# EAGLE design Magic_Desk_128_1MB_Rev1 (EAGLE 9.7.0)
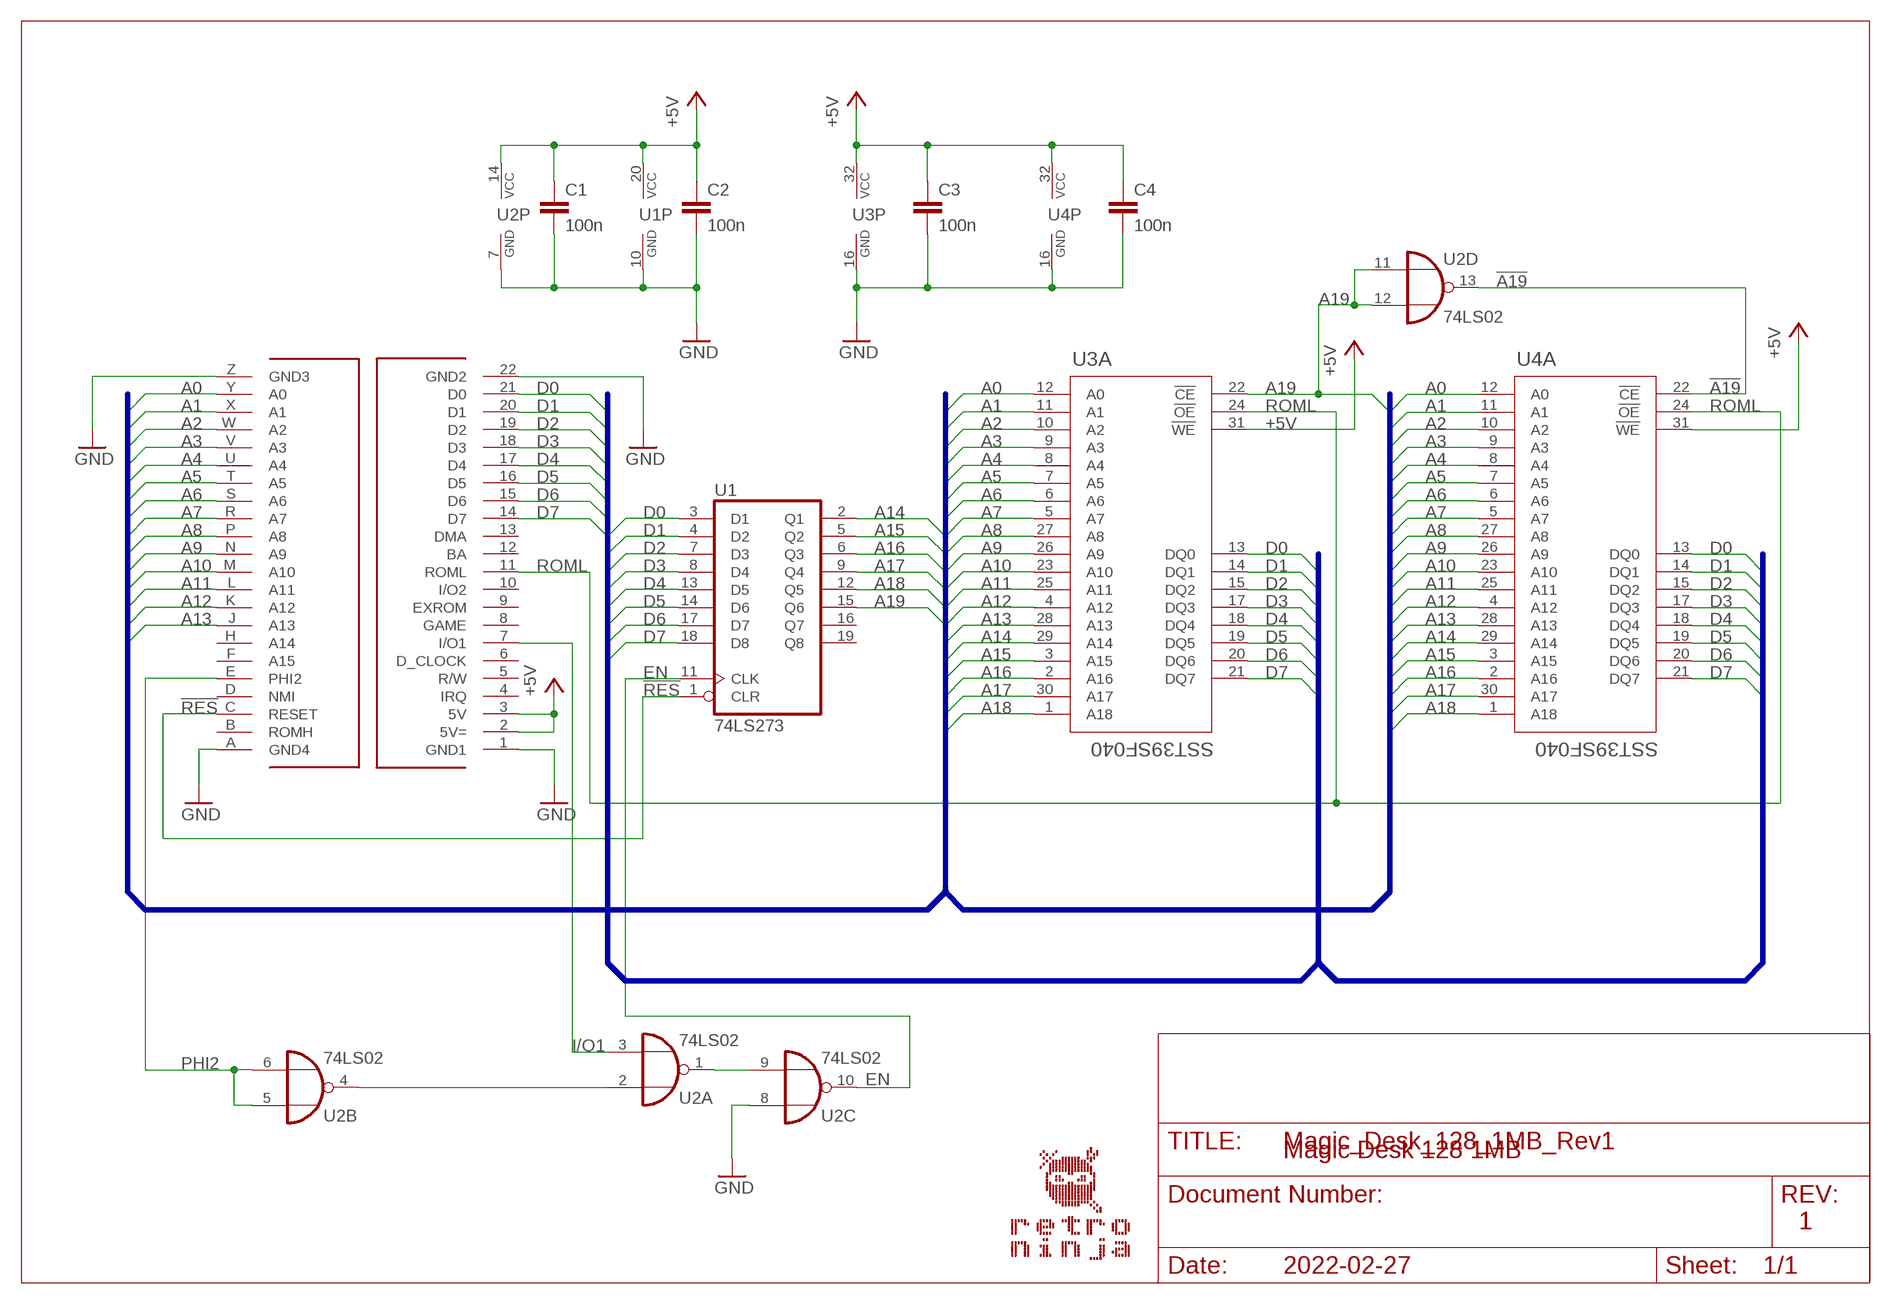
[diagram p0: schematic, sheet 1]

## Parts
C1  100n  CAPACITOR-5  [CAP_5MM_2.5X5.0_ROUND]
C2  100n  CAPACITOR-5  [CAP_5MM_2.5X5.0_ROUND]
C3  100n  CAPACITOR-5  [CAP_5MM_2.5X5.0_ROUND]
C4  100n  CAPACITOR-5  [CAP_5MM_2.5X5.0_ROUND]
CN1  C64_CARTRIDGE_PORT_CARTEDGE  [C64_CARTRIDGE_BOARDEDGE]
U1  74LS273  74HCT273N  [DIL20]
U2  74LS02  74LS02N  [DIL14]
U3  SST39SF040  SST39XX040DIL  [DIL32-6]
U4  SST39SF040  SST39XX040DIL  [DIL32-6]

## Nets
!A19: U2.13(D:O) U4.22(A:!CE)
!RES: CN1.C(RESET) U1.1(CLR)
+5V: C1.1 C2.1 C3.1 C4.1 CN1.2(5V=) CN1.3(5V) U1.20(VCC) U2.14(P:VCC) U3.31(A:!WE) U3.32(P:VCC) U4.31(A:!WE) U4.32(P:VCC)
A0: CN1.Y(A0) U3.12(A:A0) U4.12(A:A0)
A1: CN1.X(A1) U3.11(A:A1) U4.11(A:A1)
A2: CN1.W(A2) U3.10(A:A2) U4.10(A:A2)
A3: CN1.V(A3) U3.9(A:A3) U4.9(A:A3)
A4: CN1.U(A4) U3.8(A:A4) U4.8(A:A4)
A5: CN1.T(A5) U3.7(A:A5) U4.7(A:A5)
A6: CN1.S(A6) U3.6(A:A6) U4.6(A:A6)
A7: CN1.R(A7) U3.5(A:A7) U4.5(A:A7)
A8: CN1.P(A8) U3.27(A:A8) U4.27(A:A8)
A9: CN1.N(A9) U3.26(A:A9) U4.26(A:A9)
A10: CN1.M(A10) U3.23(A:A10) U4.23(A:A10)
A11: CN1.L(A11) U3.25(A:A11) U4.25(A:A11)
A12: CN1.K(A12) U3.4(A:A12) U4.4(A:A12)
A13: CN1.J(A13) U3.28(A:A13) U4.28(A:A13)
A14: U1.2(Q1) U3.29(A:A14) U4.29(A:A14)
A15: U1.5(Q2) U3.3(A:A15) U4.3(A:A15)
A16: U1.6(Q3) U3.2(A:A16) U4.2(A:A16)
A17: U1.9(Q4) U3.30(A:A17) U4.30(A:A17)
A18: U1.12(Q5) U3.1(A:A18) U4.1(A:A18)
A19: U1.15(Q6) U2.11(D:I0) U2.12(D:I1) U3.22(A:!CE)
D0: CN1.21(D0) U1.3(D1) U3.13(A:DQ0) U4.13(A:DQ0)
D1: CN1.20(D1) U1.4(D2) U3.14(A:DQ1) U4.14(A:DQ1)
D2: CN1.19(D2) U1.7(D3) U3.15(A:DQ2) U4.15(A:DQ2)
D3: CN1.18(D3) U1.8(D4) U3.17(A:DQ3) U4.17(A:DQ3)
D4: CN1.17(D4) U1.13(D5) U3.18(A:DQ4) U4.18(A:DQ4)
D5: CN1.16(D5) U1.14(D6) U3.19(A:DQ5) U4.19(A:DQ5)
D6: CN1.15(D6) U1.17(D7) U3.20(A:DQ6) U4.20(A:DQ6)
D7: CN1.14(D7) U1.18(D8) U3.21(A:DQ7) U4.21(A:DQ7)
EN: U1.11(CLK) U2.10(C:O)
GND: C1.2 C2.2 C3.2 C4.2 CN1.1(GND1) CN1.22(GND2) CN1.A(GND4) CN1.Z(GND3) U1.10(GND) U2.7(P:GND) U2.8(C:I0) U3.16(P:GND) U4.16(P:GND)
I/O1: CN1.7(I/O1) U2.3(A:I1)
N$3: U2.2(A:I0) U2.4(B:O)
N$6: U2.1(A:O) U2.9(C:I1)
PHI2: CN1.E(PHI2) U2.5(B:I0) U2.6(B:I1)
ROML: CN1.11(ROML) U3.24(A:!OE) U4.24(A:!OE)
Unconnected: CN1.4(IRQ) CN1.5(R/W) CN1.6(D_CLOCK) CN1.8(GAME) CN1.9(EXROM) CN1.10(I/O2) CN1.12(BA) CN1.13(DMA) CN1.B(ROMH) CN1.D(NMI) CN1.F(A15) CN1.H(A14) U1.16(Q7) U1.19(Q8)

## Buses
ADDR:A[0..21]
DATA:D[0..7]

## Notes on the sheet
- Magic Desk 128 1MB
- 1
- 2022-02-27

## Library data of the parts
C1-C4 = Per (Fusion 360):CAPACITOR
CN1 = Per (Fusion 360):C64_CARTRIDGE_PORT
U1 = 74xx-eu:74*273: Octal D type FLIP FLOP, clear
U2 = 74xx-eu:74*02: Quad 2-input NOR gate
U3 U4 = Per (Fusion 360):SST39XX040

## Board
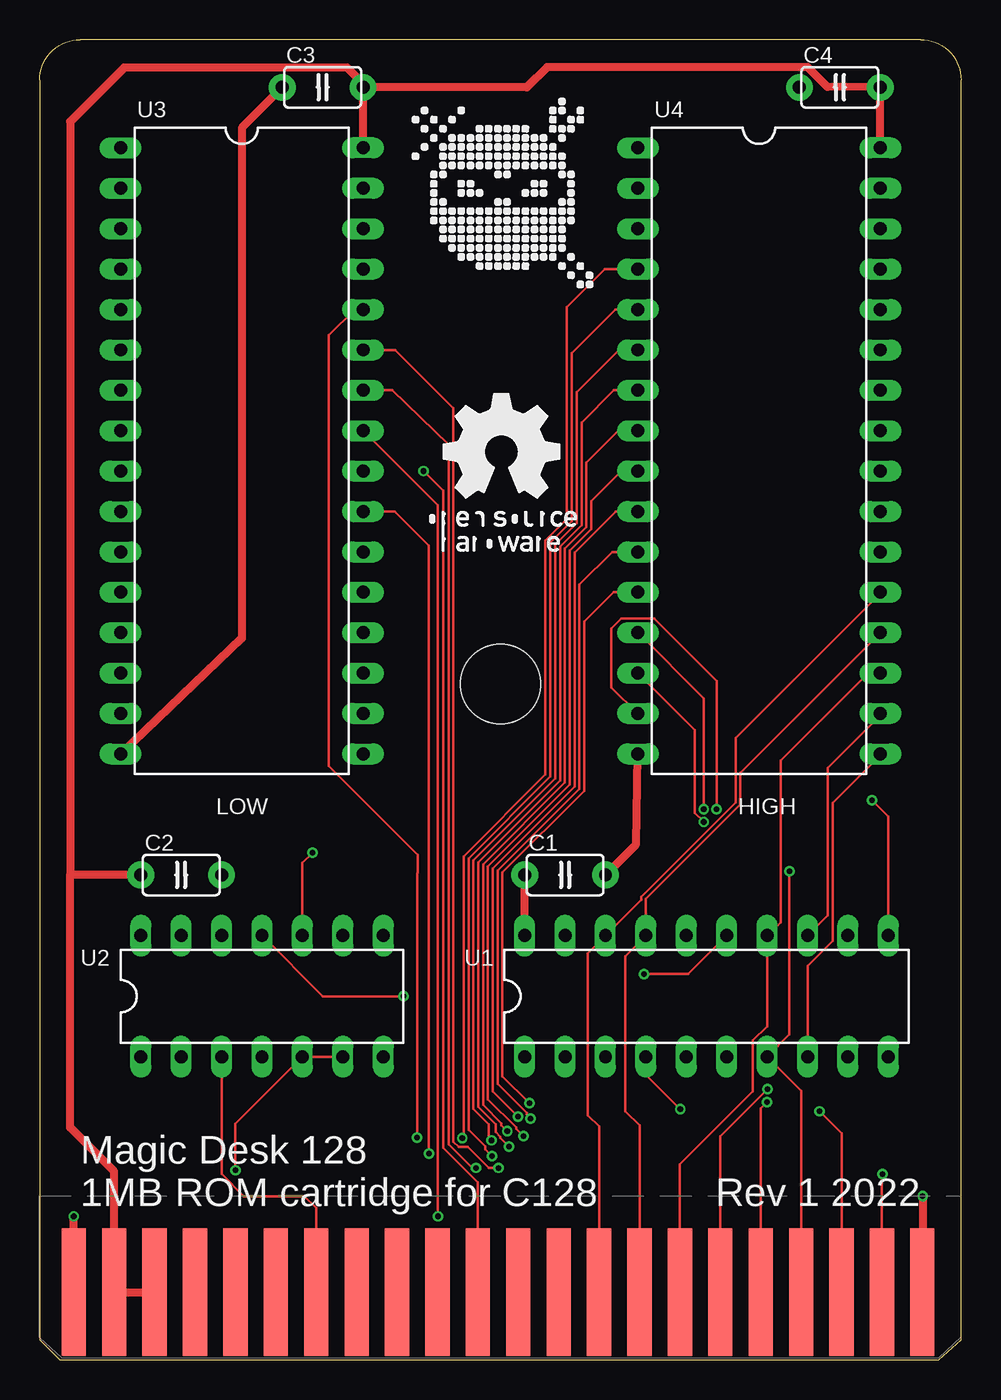
[diagram p1: board, top side]
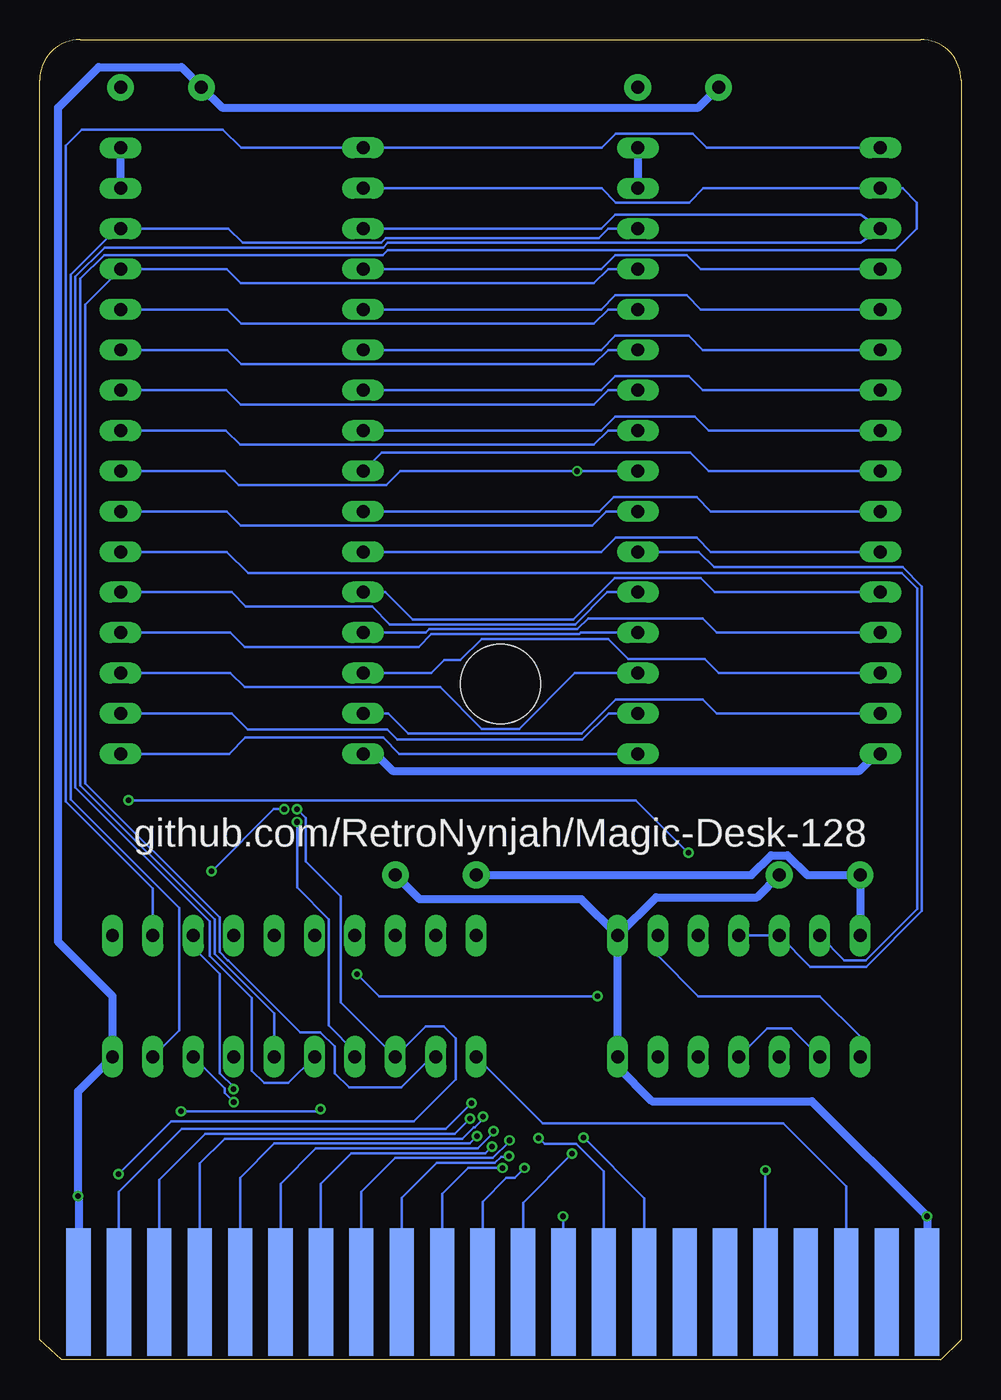
[diagram p2: board, bottom side, seen from below]

Size 57.91 x 83 mm. Coordinates in mm from the lower left corner, seen from the top.
Outline: 57.91,1.27 57.91,80.46 arc91 55.37,83 2.54,83 arc91 0,80.46 0,1.27 1.27,0 56.52,0 57.91,1.27
Copper layers (1*16): Top 0.035mm / dielectric 1.5mm / Bottom 0.035mm
Design rules "SeeedStudio_2layer_DRU_no_angle_20140221": minimum track width 6mil, minimum drill 12mil, track to track 6mil, track to pad 6mil, pad to pad 6mil, via to via 6mil, smd to smd 0mil, copper to edge 10mil, drill to drill 10mil, minimum pad ring 10mil, minimum via ring 6mil, stop-mask expansion 2mil, vias tented up to drill 100mil, thermal gap 10mil
Holes 5 mm at 28.96,42.5

### Footprints (pad centres in the part's own frame; a part is rotated, then mirrored left to right if it is on the bottom)
CAP_5MM_2.5X5.0_ROUND = drill 0.813 pad 1.676: 1 -2.54,0; 2 2.54,0
C64_CARTRIDGE_BOARDEDGE = smd 1.524 x 8.001: 1 2.159,4.115; 2 4.699,4.115; 3 7.239,4.115; 4 9.779,4.115; 5 12.319,4.115; 6 14.859,4.115; 7 17.399,4.115; 8 19.939,4.115; 9 22.479,4.115; 10 25.019,4.115; 11 27.559,4.115; 12 30.099,4.115; 13 32.639,4.115; 14 35.179,4.115; 15 37.719,4.115; 16 40.259,4.115; 17 42.799,4.115; 18 45.339,4.115; 19 47.879,4.115; 20 50.419,4.115; 21 52.959,4.115; 22 55.499,4.115 | smd 1.524 x 8.001 bottom: A 2.159,4.115; B 4.699,4.115; C 7.239,4.115; D 9.779,4.115; E 12.319,4.115; F 14.859,4.115; H 17.399,4.115; J 19.939,4.115; K 22.479,4.115; L 25.019,4.115; M 27.559,4.115; N 30.099,4.115; P 32.639,4.115; R 35.179,4.115; S 37.719,4.115; T 40.259,4.115; U 42.799,4.115; V 45.339,4.115; W 47.879,4.115; X 50.419,4.115; Y 52.959,4.115; Z 55.499,4.115
DIL20 = drill 0.813 long: 1 -11.43,-3.81; 2 -8.89,-3.81; 3 -6.35,-3.81; 4 -3.81,-3.81; 5 -1.27,-3.81; 6 1.27,-3.81; 7 3.81,-3.81; 8 6.35,-3.81; 9 8.89,-3.81; 10 11.43,-3.81; 11 11.43,3.81; 12 8.89,3.81; 13 6.35,3.81; 14 3.81,3.81; 15 1.27,3.81; 16 -1.27,3.81; 17 -3.81,3.81; 18 -6.35,3.81; 19 -8.89,3.81; 20 -11.43,3.81
DIL14 = drill 0.813 long: 1 -7.62,-3.81; 2 -5.08,-3.81; 3 -2.54,-3.81; 4 0,-3.81; 5 2.54,-3.81; 6 5.08,-3.81; 7 7.62,-3.81; 8 7.62,3.81; 9 5.08,3.81; 10 2.54,3.81; 11 0,3.81; 12 -2.54,3.81; 13 -5.08,3.81; 14 -7.62,3.81
DIL32-6 = drill 0.813 long: 1 -16.51,-7.62; 2 -13.97,-7.62; 3 -11.43,-7.62; 4 -8.89,-7.62; 5 -6.35,-7.62; 6 -3.81,-7.62; 7 -1.27,-7.62; 8 1.27,-7.62; 9 3.81,-7.62; 10 6.35,-7.62; 11 8.89,-7.62; 12 11.43,-7.62; 13 13.97,-7.62; 14 16.51,-7.62; 15 19.05,-7.62; 16 21.59,-7.62; 17 21.59,7.62; 18 19.05,7.62; 19 16.51,7.62; 20 13.97,7.62; 21 11.43,7.62; 22 8.89,7.62; 23 6.35,7.62; 24 3.81,7.62; 25 1.27,7.62; 26 -1.27,7.62; 27 -3.81,7.62; 28 -6.35,7.62; 29 -8.89,7.62; 30 -11.43,7.62; 31 -13.97,7.62; 32 -16.51,7.62

### Placement (x,y rotation side)
C1  33.02,30.48 0 top
C2  8.89,30.48 0 top
C3  17.78,80.01 180 top
C4  50.29,80.01 180 top
CN1  -0.02,0.14 0 top
U1  41.91,22.86 0 top
U2  13.97,22.86 0 top
U3  12.7,59.69 270 top
U4  45.21,59.69 270 top
U$1  [RETRONINJA_NOTEXT_12MM]  29.08,73.66 0 top
U$2  [OSHW_10MM]  24.26,50.8 0 top

### Tracks (layer width: path | path; a pad name or v marks a point on that pad's centre or on a via)
!A19
  Bottom 0.152: U2.13 7.34,25.12 5.98,25.12 2.77,28.33 2.77,48.5 3.72,49.45 44.8,49.45 46.15,50.8 U4.22
!RES
  Bottom 0.152: CN1.C 7.22,10.9 11.18,14.86 26.29,14.86 U1.1
+5V
  Top 0.508: CN1.3 CN1.2 4.68,11.83 1.91,14.61 1.91,30.48 | 1.91,30.48 1.91,77.85 5.31,81.25 19.31,81.25 20.32,80.25 C3.1 | C2.1 1.91,30.48 | U1.20 C1.1 | C3.1 30.62,80.01 31.89,81.28 48.27,81.28 49.51,80.03 C4.1 U4.32 | U3.32 C3.1
  Bottom 0.508: U3.32 U3.31 | U2.14 C2.1 9.67,30.48 10.91,31.73 11.95,31.73 13.19,30.48 C1.1 | U4.31 U4.32
A0  (via drill 0.35)
  Top 0.152: U4.12 36.07,48.26 34.23,46.42 34.23,35.78 29.08,30.64 29.08,17.83 v30.77,16.14
  Bottom 0.152: CN1.Y 52.94,10.56 48.99,14.51 32.4,14.51 v30.77,16.14 | U4.12 36.19,48.26 34.48,46.55 24.37,46.55 21.77,49.15 16.37,49.15 15.48,48.26 U3.12
A1  (via drill 0.35)
  Top 0.152: U4.11 35.98,50.8 33.92,48.73 33.92,35.91 28.78,30.76 28.78,17.35 30.61,15.52 30.61,15.42 v30.86,15.16
  Bottom 0.152: U4.11 22.61,50.8 21.72,51.69 16.62,51.69 15.73,50.8 U3.11 | CN1.X 50.4,11.32 47.52,14.21 31.82,14.21 v30.86,15.16
A2  (via drill 0.35)
  Top 0.152: U4.10 36.21,53.34 33.62,50.74 33.62,36.03 28.47,30.89 28.47,16.87 v30.05,15.29
  Bottom 0.152: U4.10 22.73,53.34 21.84,54.23 16.62,54.23 15.73,53.34 U3.10 | CN1.W 47.86,12.34 46.3,13.9 31.35,13.9 30.65,14.61 30.59,14.61 30.05,15.14 v30.05,15.29
A3  (via drill 0.35)
  Top 0.152: U4.9 36.54,55.88 34.66,54 34.66,52.22 33.31,50.87 33.31,36.16 28.17,31.02 28.17,16.38 29.94,14.61 29.94,14.53 v30.42,14.05
  Bottom 0.152: U4.9 36.42,57.05 17.03,57.05 15.86,55.88 U3.9 | CN1.V 45.32,11.45 43.17,13.6 30.87,13.6 v30.42,14.05
A4  (via drill 0.35)
  Top 0.152: U4.8 36.37,58.42 34.36,56.41 34.36,52.35 33.01,50.99 33.01,36.28 27.86,31.14 27.86,16.02 29.02,14.87 29.02,14.75 v29.38,14.38
  Bottom 0.152: U4.8 22.62,58.42 21.73,59.31 16.75,59.31 15.86,58.42 U3.8 | CN1.U 42.78,11.07 40.55,13.29 30.39,13.29 29.38,14.3 v29.38,14.38
A5  (via drill 0.35)
  Top 0.152: U4.7 36.09,60.96 34.05,58.93 34.05,52.47 32.7,51.12 32.7,36.41 27.56,31.27 27.56,15.89 28.66,14.79 28.66,14.32 28.95,14.03 28.95,13.94 v29.49,13.41
  Bottom 0.152: U4.7 22.62,60.96 21.73,61.85 17.13,61.85 16.24,60.96 U3.7 | CN1.T 40.24,11.07 38.32,12.99 29.91,12.99 v29.49,13.41
A6  (via drill 0.35)
  Top 0.152: U4.6 36.39,63.5 33.75,60.86 33.75,52.6 32.4,51.25 32.4,36.54 27.25,31.39 27.25,15.77 28.23,14.8 28.23,13.97 v28.4,13.79
  Bottom 0.152: U4.6 22.62,63.5 21.73,64.39 17.13,64.39 16.24,63.5 U3.6 | CN1.S 37.7,10.56 35.58,12.68 29.43,12.68 28.4,13.71 v28.4,13.79
A7  (via drill 0.35)
  Top 0.152: U4.5 36.19,66.04 33.45,63.3 33.45,52.73 32.09,51.37 32.09,36.66 26.95,31.52 26.95,14.46 28,13.41 28,13.23 v28.43,12.8
  Bottom 0.152: U4.5 22.62,66.04 21.73,66.93 17.26,66.93 16.37,66.04 U3.5 | CN1.R 35.16,10.18 32.96,12.38 29.3,12.38 28.91,12.77 28.46,12.77 v28.43,12.8
A8  (via drill 0.35)
  Top 0.152: U3.27 22.35,63.5 26,59.85 26,13.71 26.32,13.38 26.9,13.38 28.22,12.06 v28.83,12.06
  Bottom 0.152: U4.27 46.13,63.5 45.24,62.61 23.08,62.61 22.19,63.5 U3.27 | CN1.P 32.62,10.44 30.99,12.06 v28.83,12.06
A9  (via drill 0.35)
  Top 0.152: v27.43,12.06 27.18,12.06 25.69,13.55 25.69,57.54 22.16,60.96 U3.26
  Bottom 0.152: U4.26 46.18,60.96 45.29,60.07 23.08,60.07 22.19,60.96 U3.26 | v27.43,12.06 28.07,11.43 28.57,11.43 30.08,9.93 CN1.N
A10  (via drill 0.35)
  Top 0.152: U3.23 22.31,53.34 24.46,51.19 v24.46,12.95
  Bottom 0.152: U4.23 46.16,53.34 45.27,52.45 23.19,52.45 22.3,53.34 U3.23 | v24.46,12.95 27.54,9.88 CN1.M
A11  (via drill 0.35)
  Top 0.152: U3.25 20.34,58.42 25.02,53.74 v25.02,9.02
  Bottom 0.152: U4.25 46.21,58.42 45.32,57.53 23.08,57.53 22.19,58.42 U3.25 | v25.02,9.02 25,8.99 CN1.L
A12  (via drill 0.35)
  Top 0.152: U4.4 35.53,68.58 33.14,66.19 33.14,52.85 31.79,51.5 31.79,36.79 26.64,31.65 26.64,14.03 v26.55,13.94
  Bottom 0.152: U4.4 22.62,68.58 21.73,69.47 17.26,69.47 16.37,68.58 U3.4 | v26.55,13.94 26.18,13.56 24.18,13.56 22.46,11.84 CN1.K
A13  (via drill 0.35)
  Top 0.152: v23.72,13.97 23.72,30.58 23.75,30.61 23.75,31.75 18.16,37.34 18.16,64.41 19.79,66.04 U3.28
  Bottom 0.152: U4.28 46.13,66.04 45.24,65.15 23.08,65.15 22.19,66.04 U3.28 | CN1.J 19.92,10.16 v23.72,13.97
A14
  Bottom 0.152: U3.29 22.19,68.58 23.08,67.69 45.27,67.69 46.16,68.58 U4.29 55.06,66.35 55.06,36.25 46.61,27.8 46.61,25.64 46.09,25.12 46.08,25.12 41.55,20.6 40.27,20.6 39.37,19.7 39.37,18.02 38.47,17.12 35.19,17.12 33.26,19.05 U1.2
A15
  Bottom 0.152: U4.3 22.62,71.12 21.73,72.01 6.32,72.01 U3.3 6.32,70.23 36.02,70.23 36.33,69.93 53.83,69.93 55.67,68.09 55.67,36 47.22,27.55 47.22,25.39 44.58,22.75 44.58,18.16 43.81,17.4 42.29,17.4 U1.5
A16
  Bottom 0.152: U1.6 43.18,21.78 46.91,25.52 46.91,27.67 55.37,36.12 55.37,67.97 53.86,69.47 36.35,69.47 36.05,69.77 4.14,69.77 2.79,71.12 2.79,72.77 3.68,73.66 U3.2 16.21,73.66 17.1,72.77 21.7,72.77 22.58,73.66 U4.2
A17
  Bottom 0.152: U3.30 22.19,71.12 22.78,70.54 36.15,70.54 36.45,70.23 45.17,70.23 46.06,71.12 U4.30 53.07,71.12 55.97,68.22 55.97,35.24 49.15,28.41 49.15,20.7 U1.9
A18
  Bottom 0.152: U3.1 15.99,76.2 16.88,77.09 21.7,77.09 22.58,76.2 U4.1 45.26,76.2 46.4,77.34 55.28,77.34 56.28,76.34 56.28,35.11 50.8,29.63 U1.12
A19  (via drill 0.35)
  Top 0.152: U2.11 17.78,22.86 v22.86,22.86 | v37.97,24.26 40.77,24.26 U1.15
  Bottom 0.152: U3.22 16.48,50.8 15.51,49.84 3.67,49.84 2.46,48.63 2.46,28.21 5.96,24.71 9.47,24.71 U2.12 U2.11 | v22.86,22.86 36.58,22.86 v37.97,24.26
D0  (via drill 0.35)
  Top 0.152: U4.13 37.61,45.72 41.74,41.59 v41.74,34.62 | CN1.21 52.94,11.66 v52.96,11.68
  Bottom 0.152: U4.13 33.65,45.72 33.43,45.94 24.12,45.94 23.45,46.61 16.24,46.61 15.35,45.72 U3.13 | v52.96,11.68 49.66,14.99 34.4,14.99 31.75,17.64 31.75,20.19 32.51,20.95 33.66,20.95 U1.3 38.99,22.48 38.99,29.13 41.18,31.33 41.18,34.07 v41.74,34.62
D1  (via drill 0.35)
  Top 0.152: CN1.20 50.4,14.25 v49.02,15.62 | v40.26,15.75 38.1,17.91 U1.4 | v41.74,33.82 41.74,33.84 41.18,34.39 41.18,39.58 U4.14
  Bottom 0.152: U4.14 33.29,43.18 32.48,43.99 31.47,43.99 30.13,45.33 22.2,45.33 20.93,44.07 16.12,44.07 15.23,43.18 U3.14 | U1.4 38.1,19.37 39.75,21.02 39.75,27.7 41.74,29.68 v41.74,33.82 | v49.02,15.62 40.39,15.62 v40.26,15.75
D2  (via drill 0.35)
  Top 0.152: CN1.19 47.86,16.91 U1.7 47.12,20.45 v47.12,30.71 | U4.15 37.57,40.64 35.93,42.28 35.93,45.98 36.56,46.61 38.62,46.61 42.55,42.69 v42.55,34.62
  Bottom 0.152: U4.15 36.02,40.64 34.74,39.37 23.86,39.37 21.7,41.53 16.24,41.53 15.35,40.64 U3.15 | v47.12,30.71 43.2,34.62 v42.55,34.62
D3  (via drill 0.35)
  Top 0.152: U1.8 48.26,24.75 49.84,26.33 49.84,35 52.83,38 U4.17 | CN1.18 45.32,15.8 v45.72,16.2
  Bottom 0.152: U4.17 46.01,38.1 44.99,39.12 36.32,39.12 35.31,38.1 U3.17 | U1.8 46.29,17.08 46.29,16.78 v45.72,16.21 v45.72,16.2
D4  (via drill 0.35)
  Top 0.152: U4.18 52.83,40.52 49.53,37.22 49.53,27.94 U1.13 | CN1.17 42.78,14.05 v45.73,17.01
  Bottom 0.152: U3.18 22.15,40.64 23.8,38.99 35.43,38.99 36.07,39.62 44.84,39.62 45.85,40.64 U4.18 | U1.13 48.26,25.92 46.61,24.27 46.61,18.02 45.73,17.14 v45.73,17.01
D5
  Top 0.152: U4.19 52.07,43.18 46.56,37.67 46.56,27.51 U1.14 45.72,20.97 44.83,20.08 44.83,16.89 40.24,12.3 CN1.16
  Bottom 0.152: U4.19 45.93,43.18 45.04,42.29 32.75,42.29 30.13,39.67 27.78,39.67 24.27,43.18 U3.19
D6
  Top 0.152: U4.20 52.83,45.7 44.04,36.91 44.04,34.9 38.1,28.96 U1.17 36.8,25.38 36.8,15.63 37.7,14.74 CN1.15
  Bottom 0.152: U4.20 45.93,45.72 45.04,44.83 34.11,44.83 33.3,45.63 23.99,45.63 23.91,45.72 U3.20
D7
  Top 0.152: CN1.14 35.16,14.66 34.44,15.38 34.44,25.55 U1.18 37.8,28.91 37.8,29.09 43.74,35.03 43.74,39.09 52.83,48.18 U4.21
  Bottom 0.152: U4.21 45.85,48.26 44.96,47.37 37.02,47.37 35.9,46.24 24.25,46.24 22.23,48.26 U3.21
EN  (via drill 0.35)
  Top 0.152: U1.11 53.34,34.16 v52.32,35.18 | v17.14,31.88 16.51,31.24 U2.10
  Bottom 0.152: v52.32,35.18 20.45,35.18 v17.14,31.88
GND  (via drill 0.35)
  Top 0.508: CN1.1 v2.14,9.01 v2.13,9.02 | v55.5,10.29 55.5,4.28 CN1.22 | C1.2 37.48,32.4 U4.16 | C3.2 12.7,77.47 12.7,45.37 U3.16
  Bottom 0.508: CN1.1 v2.13,9.02 9.37,16.26 19.43,16.26 21.59,18.41 U2.7 U2.8 | CN1.22 55.48,10.27 v55.5,10.29 55.5,16.89 U1.10 53.34,22.86 56.76,26.28 56.76,78.73 54.21,81.28 49,81.28 C4.2 46.46,78.74 16.51,78.74 C3.2 | U2.8 19.18,29.08 12.83,29.08 C2.2 | U2.8 23.88,28.96 34.04,28.96 C1.2 | U4.16 36.8,38.1 35.73,37.03 6.39,37.03 5.33,38.09 U3.16
I/O1
  Top 0.152: CN1.7 17.38,9.55 16.64,10.29 12.83,10.29 11.43,11.68 U2.3
N$3
  Bottom 0.152: U2.2 10.67,20.83 12.19,20.83 U2.4
N$6
  Bottom 0.152: U2.1 6.35,20.32 8.89,22.86 16.51,22.86 19.05,25.4 U2.9
PHI2  (via drill 0.35)
  Top 0.152: v12.29,11.91 12.29,14.83 U2.5 U2.6
  Bottom 0.152: CN1.E v12.3,11.91 v12.29,11.91
ROML  (via drill 0.35)
  Top 0.152: CN1.11 27.54,11.14 25.37,13.31 25.37,54.64 v24.13,55.88
  Bottom 0.152: U4.24 46.28,55.88 45.4,54.99 36.15,54.99 35.26,55.88 v24.13,55.88 U3.24

### Text on the board
tPlace: LOW | HIGH | Magic Desk 128 / 1MB ROM cartridge for C128 | Rev 1 2022
bPlace: github.com/RetroNynjah/Magic-Desk-128